# Altium project ColorESP32.PrjPcb
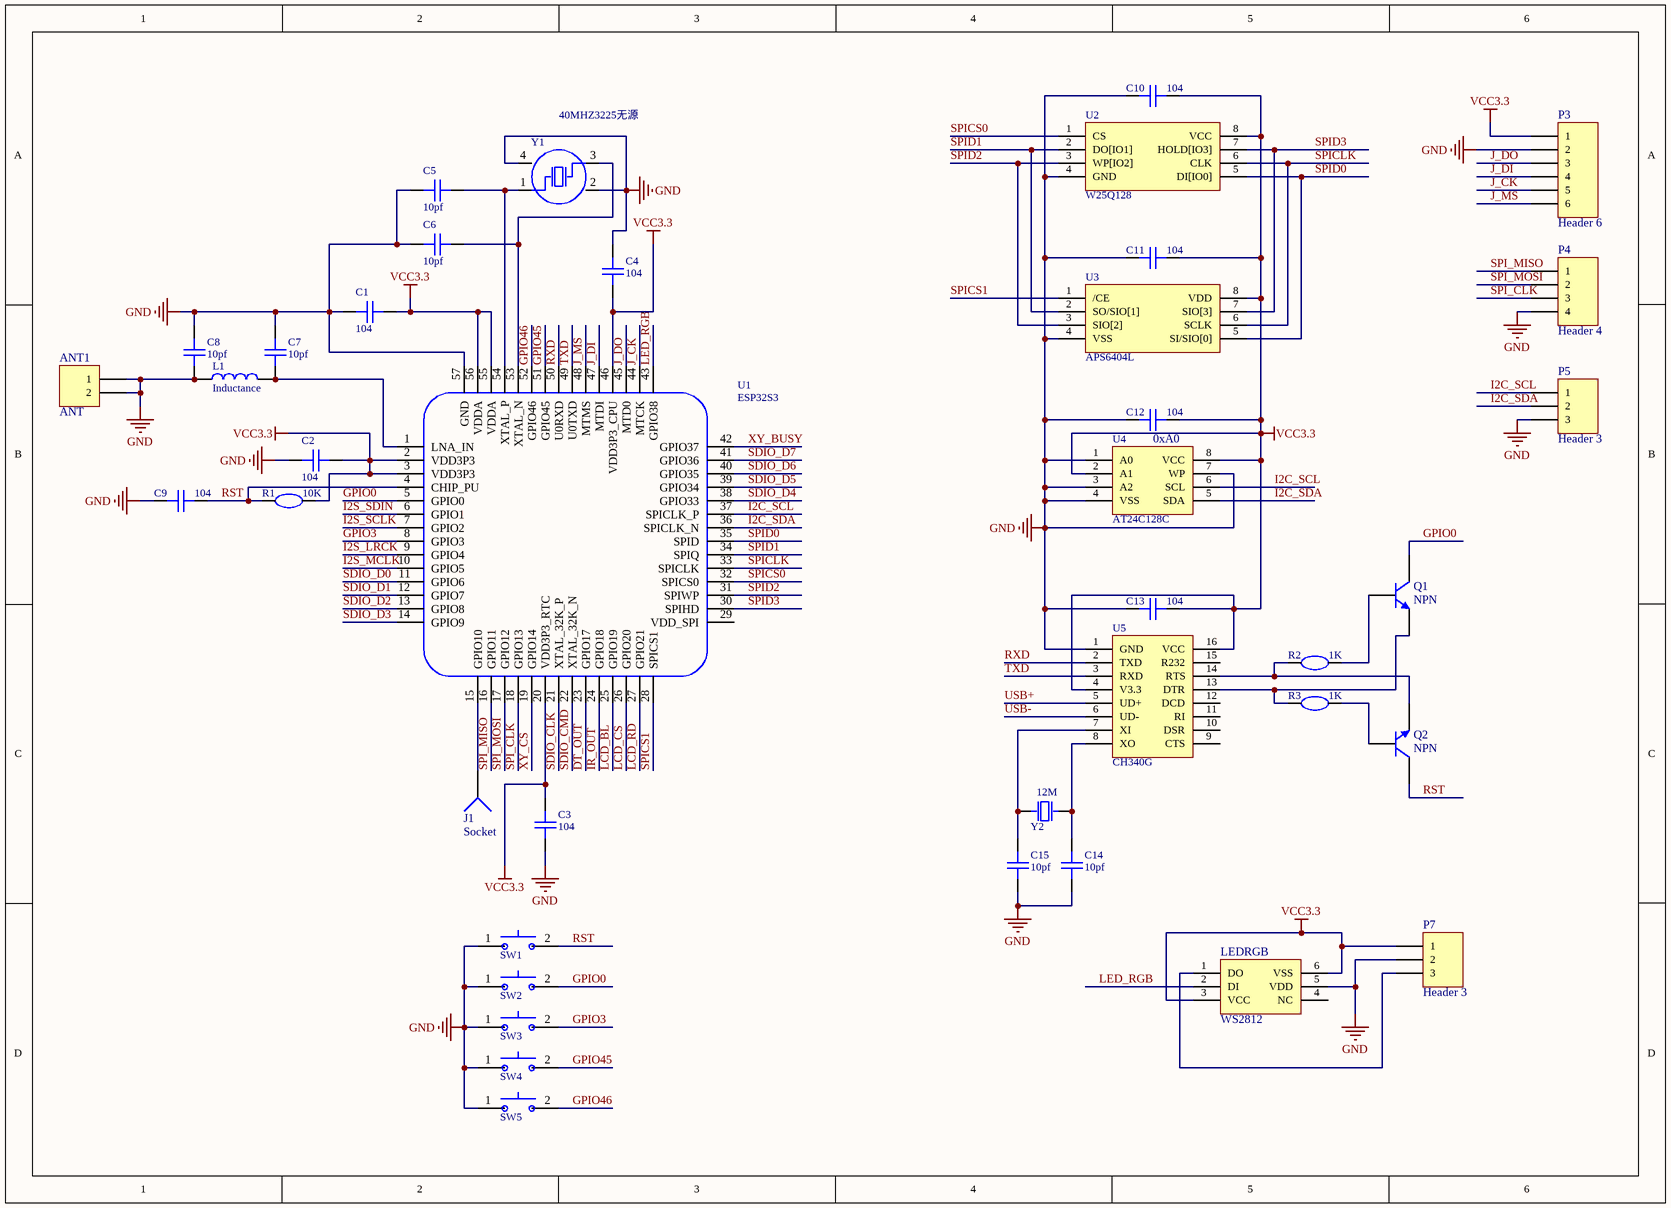
[diagram p0: 1_MCU.schdoc]
3 sheets, 82 parts. Net scope: global (net labels, ports and power ports of the same name join across sheets).
Board files: pcb.pcbdoc, PCB1_1.PcbDoc, PCB1.PcbDoc, PCB2.PcbDoc
Sheets:
  1_MCU.schdoc
  2_MODUE.schdoc
  3_AUDIO.schdoc

## Sheet 1_MCU.schdoc
size 312 x 225 mm; SheetNumber: 1; SheetTotal: 3

### Parts
ANT1  ANT  [MINI_ANT]
C1  104  [0402R]
C2  104  [0402R]
C3  104  [0402R]
C4  104  [0402R]
C5  10pf  [0603]
C6  10pf  [0603]
C7  10pf  [0603]
C8  10pf  [0603]
C9  104  [0402R]
C10  104  [0402R]
C11  104  [0402R]
C12  104  [0402R]
C13  104  [0402R]
C14  10pf  [0603]
C15  10pf  [0603]
J1  Socket  [PIN1]
L1  Inductance  [0603]
LEDRGB  WS2812  [LED-SMD_6P-L5.0-W5.0-TL]
P3  Header 6  [HDR1X6]
P4  Header 4  [HDR1X4]
P5  Header 3  [HDR1X3]
P7  Header 3  [HDR1X3]
Q1  NPN  [SOT-23-3_L2.9-W1.3-P1.90-LS2.4-BR]
Q2  NPN  [SOT-23-3_L2.9-W1.3-P1.90-LS2.4-BR]
R1  10K  [0402R]
R2  1K  [0402R]
R3  1K  [0402R]
SW1  无声微动开关  [SW-SMD_L6.0-W6.0-P6.00-LS6.6]  (value not drawn)
SW2  无声微动开关  [SW-SMD_L6.0-W6.0-P6.00-LS6.6]  (value not drawn)
SW3  无声微动开关  [SW-SMD_L6.0-W6.0-P6.00-LS6.6]  (value not drawn)
SW4  无声微动开关  [SW-SMD_L6.0-W6.0-P6.00-LS6.6]  (value not drawn)
SW5  无声微动开关  [SW-SMD_L6.0-W6.0-P6.00-LS6.6]  (value not drawn)
U1  ESP32S3  [ESP32-S3-QFN56]
U2  W25Q128  [SOIC-8_L5.3-W5.3-P1.27-LS8.0-BL]
U3  APS6404L  [SOP-8_L4.9-W3.9-P1.27-LS6.0-BL]
U4  AT24C128C  [SOIC-8_L4.9-W3.9-P1.27-LS6.0-BL]
U5  CH340G  [CH340G]
Y1  Name: 40MHZ3225无源  [CRYSTAL-SMD_4P-L3.2-W2.5-BL]  (hidden comment: CRYSTAL1)
Y2  12M  [HC-49US_L11.5-W4.5-P4.88]

### Nets
GND: ANT1.1 ANT1.2 C1.1 C2.1 C3.1 C4.2 C5.1 C6.1 C7.2 C8.1 C8.2 C9.1 C10.1 C11.1 C12.1 C13.1 C14.1 C15.1 L1.1 LEDRGB.5(VDD) P3.2 P4.4 P5.3 P7.2 SW1.1 SW2.1 SW3.1 SW4.1 SW5.1 U1.57(GND) U2.4(GND) U3.4(VSS) U4.1(A0) U4.3(A2) U4.4(VSS) U4.7(WP) U5.1(GND) Y1.2(GND) Y1.4(GND)
VCC3.3: C1.2 C2.2 C3.2 C4.1 C10.2 C11.2 C12.2 C13.2 LEDRGB.3(VCC) LEDRGB.6(VSS) P3.1 P7.1 R1.2 U1.2(VDD3P3) U1.3(VDD3P3) U1.20(VDD3P3_RTC) U1.46(VDD3P3_CPU) U1.55(VDDA) U1.56(VDDA) U2.8(VCC) U3.8(VDD) U4.2(A1) U4.8(VCC) U5.4(V3.3) U5.16(VCC)
DT_OUT: U1.23(GPIO17)
GPIO0: Q1.1(C) SW2.2 U1.5(GPIO0)
GPIO3: SW3.2 U1.8(GPIO3)
GPIO45: SW4.2 U1.51(GPIO45)
GPIO46: SW5.2 U1.52(GPIO46)
I2C_SCL: P5.1 U1.37(SPICLK_P) U4.6(SCL)
I2C_SDA: P5.2 U1.36(SPICLK_N) U4.5(SDA)
I2S_LRCK: U1.9(GPIO4)
I2S_MCLK: U1.10(GPIO5)
I2S_SCLK: U1.7(GPIO2)
I2S_SDIN: U1.6(GPIO1)
IR_OUT: U1.24(GPIO18)
J_CK: P3.5 U1.44(MTCK)
J_DI: P3.4 U1.47(MTDI)
J_DO: P3.3 U1.45(MTD0)
J_MS: P3.6 U1.48(MTMS)
LCD_BL: U1.25(GPIO19)
LCD_CS: U1.26(GPIO20)
LCD_R~{D}: U1.27(GPIO21)
LED_RGB: LEDRGB.2(DI) U1.43(GPIO38)
RST: C9.2 Q2.1(C) R1.1 SW1.2 U1.4(CHIP_PU)
RXD: U1.50(U0RXD) U5.2(TXD)
SDIO_CLK: U1.21(XTAL_32K_P)
SDIO_CMD: U1.22(XTAL_32K_N)
SDIO_D0: U1.11(GPIO6)
SDIO_D1: U1.12(GPIO7)
SDIO_D2: U1.13(GPIO8)
SDIO_D3: U1.14(GPIO9)
SDIO_D4: U1.38(GPIO33)
SDIO_D5: U1.39(GPIO34)
SDIO_D6: U1.40(GPIO35)
SDIO_D7: U1.41(GPIO36)
SPI_CLK: P4.3 U1.18(GPIO13)
SPI_MISO: P4.1 U1.16(GPIO11)
SPI_MOSI: P4.2 U1.17(GPIO12)
SPICLK: U1.33(SPICLK) U2.6(CLK) U3.6(SCLK)
SPICS0: U1.32(SPICS0) U2.1(CS)
SPICS1: U1.28(SPICS1) U3.1(/CE)
SPID0: U1.35(SPID) U2.5(DI[IO0]) U3.5(SI/SIO[0])
SPID1: U1.34(SPIQ) U2.2(DO[IO1]) U3.2(SO/SIO[1])
SPID2: U1.31(SPIWP) U2.3(WP[IO2]) U3.3(SIO[2])
SPID3: U1.30(SPIHD) U2.7(HOLD[IO3]) U3.7(SIO[3])
TXD: U1.49(U0TXD) U5.3(RXD)
USB+: U5.5(UD+)
USB-: U5.6(UD-)
XY_BUSY: U1.42(GPIO37)
XY_CS: U1.19(GPIO14)
NetC5_2: C5.2 U1.54(XTAL_P) Y1.1(OSC1)
NetC6_2: C6.2 U1.53(XTAL_N) Y1.3(OSC2)
NetC7_1: C7.1 L1.2 U1.1(LNA_IN)
NetC14_2: C14.2 U5.8(XO) Y2.2(OSC2)
NetC15_2: C15.2 U5.7(XI) Y2.1(OSC1)
NetJ1_1: J1.1 U1.15(GPIO10)
NetLEDRGB_1: LEDRGB.1(DO) P7.3
NetQ1_2: Q1.2(B) R2.2
NetQ1_3: Q1.3(E) R3.1 U5.13(DTR)
NetQ2_2: Q2.2(B) R3.2
NetQ2_3: Q2.3(E) R2.1 U5.14(RTS)

Not connected (* = marked no-connect by the designer): LEDRGB 4(NC); U1 29(VDD_SPI); U5 9(CTS) 10(DSR) 11(RI) 12(DCD) 15(R232)

### Notes on the sheet
- 0xA0

### Library data of the parts
ANT1 = Header 2: LatestRevisionDate: 17-Jul-2002; LatestRevisionNote: Re-released for DXP Platform.; Publisher: Altium Limited
C1-C15 = CAP: Symbol: 0.1u; Add into BOM: yes; Origin Footprint: C0805; Device: 0.1u; Convert to PCB: yes
L1 = Inductance: Symbol: 1m; Add into BOM: yes; Origin Footprint: L1608; Device: 1m; Convert to PCB: yes
P3 = Header 6: Header, 6-Pin; LatestRevisionDate: 17-Jul-2002; LatestRevisionNote: Re-released for DXP Platform.; Publisher: Altium Limited
P4 = Header 4: Header, 4-Pin; LatestRevisionDate: 17-Jul-2002; LatestRevisionNote: Re-released for DXP Platform.; Publisher: Altium Limited
P5 P7 = Header 3: Header, 3-Pin; LatestRevisionDate: 17-Jul-2002; LatestRevisionNote: Re-released for DXP Platform.; Publisher: Altium Limited
Q1 Q2 = NPN: NPN Bipolar Transistor; Published: 8-Jun-2000; LatestRevisionDate: 17-Jul-2002; LatestRevisionNote: Re-released for DXP Platform.; PackageReference: TO-226-AA; Publisher: Altium Limited; PackageDescription: TO, Flat Index; 3 In-Line, Axial Leads; Body Dia. 4.8mm; Leads 0.55 x 0.51 mm (max); Code_JEDEC: TO-226-AA
R1-R3 = RST: Symbol: 0_; Add into BOM: yes; Origin Footprint: R0805; Device: 0_; Convert to PCB: yes
SW1-SW5 = SW: Add into BOM: yes; Symbol: 无声微动开关; Name: 无声微动开关; Device: 无声微动开关; Convert to PCB: yes; Origin Footprint: SW-SMD_L6.0-W6.0-P6.00-LS6.6
U1 = ESP32S3: Add into BOM: yes; Symbol: ESP32S3; Device: ESP32S3; Convert to PCB: yes; Origin Footprint: ESP32-S3-QFN56
U2 = W25Q128: Symbol: W25Q128JVSIQ; Add into BOM: yes; Device: W25Q128JVSIQ; Convert to PCB: yes; Origin Footprint: SOIC-8_L5.3-W5.3-P1.27-LS8.0-BL
U3 = APS6404L: Symbol: APS6404L-3SQR-SN; Add into BOM: yes; Device: APS6404L-3SQR-SN; Convert to PCB: yes; Origin Footprint: SOP-8_L4.9-W3.9-P1.27-LS6.0-BL; link: https://img.jlc.com/pdf/applyPasteComponent/2021-12-06/31098A/66796366ab5e49f0a48d07582eff2f2b/APS6404L-3SQR-SN.pdf
U4 = AT24C128C: Symbol: AT24C128C-SSHM-T; Add into BOM: yes; Device: AT24C128C-SSHM-T; Convert to PCB: yes; Origin Footprint: SOIC-8_L4.9-W3.9-P1.27-LS6.0-BL
U5 = CH340G: Add into BOM: yes; Symbol: CH340G; Device: CH340G; Convert to PCB: yes; Origin Footprint: CH340G
Y1 = CRYSTAL1: Symbol: 25MHZ3225无源; Add into BOM: yes; Device: 25MHZ3225无源; Convert to PCB: yes; Origin Footprint: CRYSTAL-SMD_4P-L3.2-W2.5-BL
Y2 = CRYSTAL: Symbol: 9B-12.288MAAJ-B; Add into BOM: yes; Name: 9B-12.288MAAJ-B; Device: 9B-12.288MAAJ-B; Convert to PCB: yes; Origin Footprint: HC-49US_L11.5-W4.5-P4.88
J1 = Socket: LatestRevisionDate: 17-Jul-2002; LatestRevisionNote: Re-released for DXP Platform.; Publisher: Altium Limited

## Sheet 2_MODUE.schdoc
size 312 x 225 mm; SheetNumber: 2; SheetTotal: 3
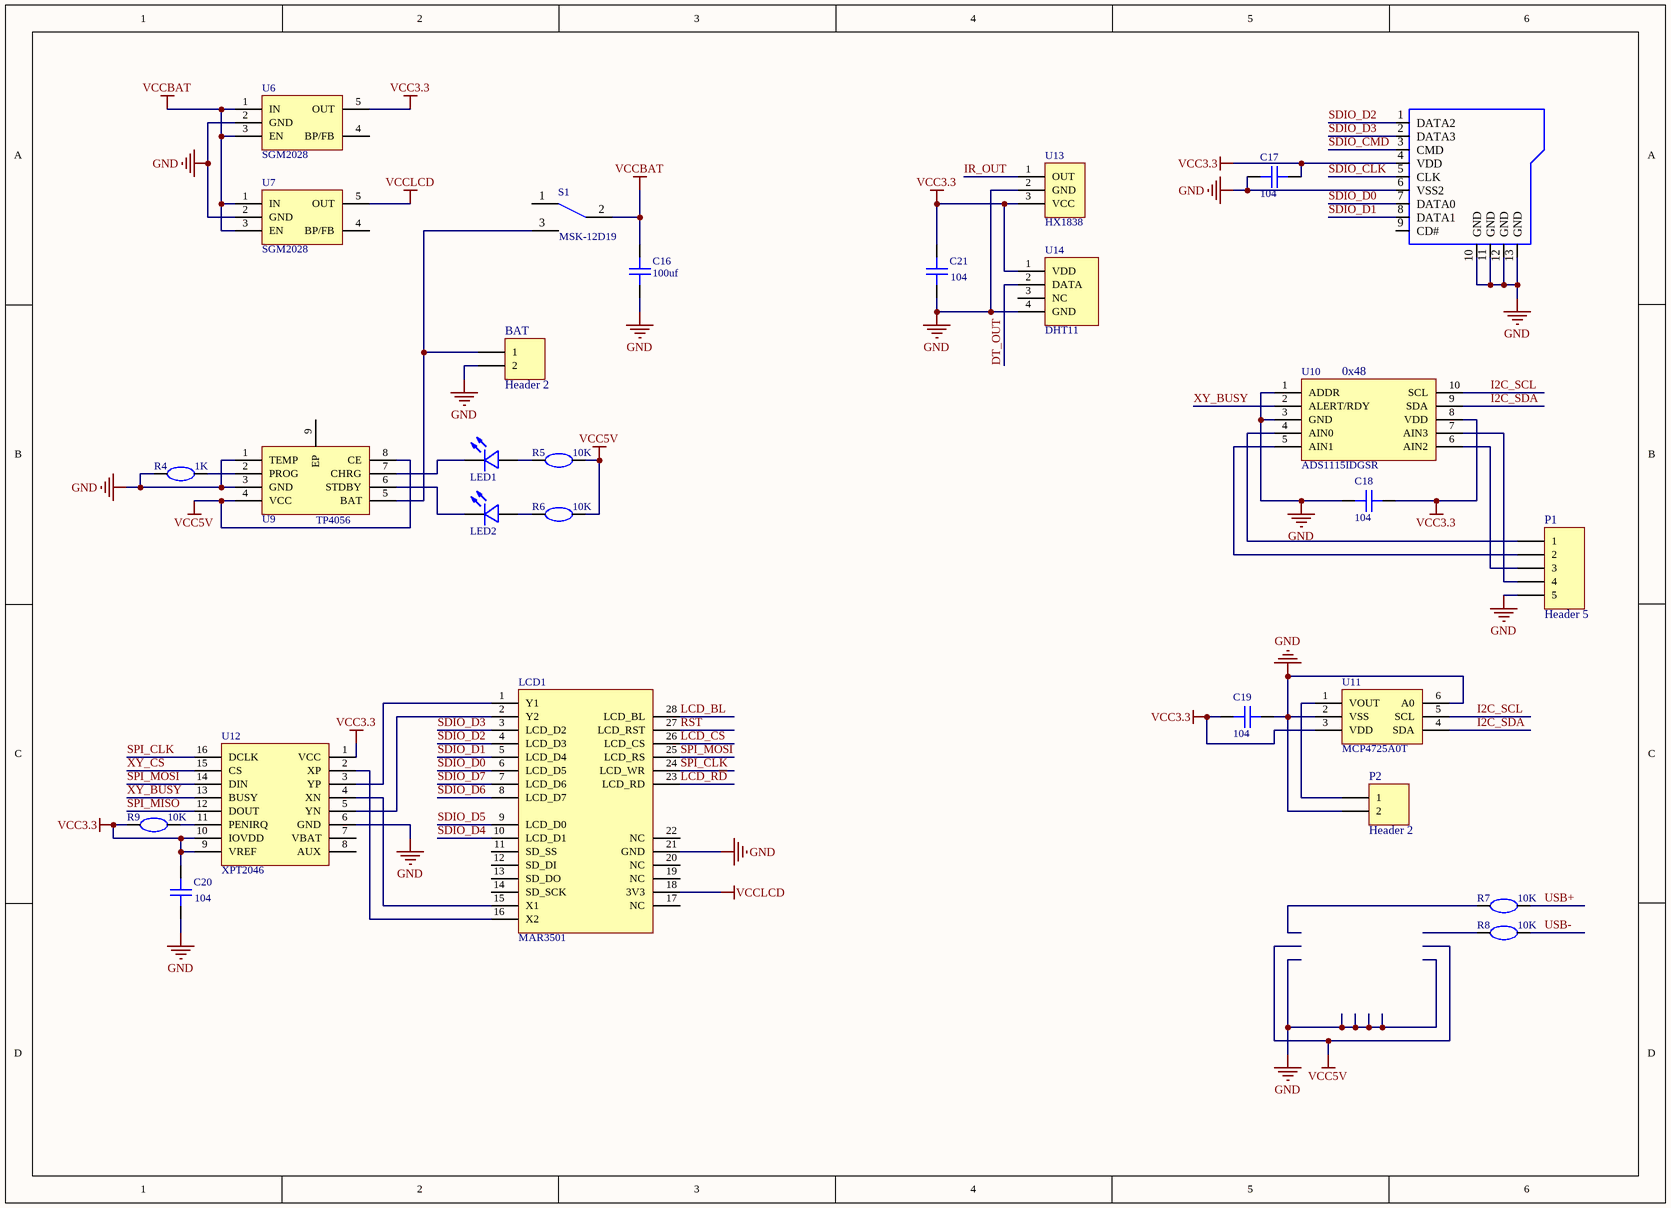
[diagram p1: 2_MODUE.schdoc]

### Parts
BAT  Header 2  [HDR1X2]
C16  100uf  [3528]
C17  104  [0402R]
C18  104  [0402R]
C19  104  [0402R]
C20  104  [0402R]
C21  104  [0402R]
LCD1  MAR3501  [MAR3501]
LED1  L-C292WDT-5A-YY  [0805]  (value not drawn)
LED2  L-C292WDT-5A-YY  [0805]  (value not drawn)
P1  Header 5  [HDR1X5]
P2  Header 2  [HDR1X2]
R4  1K  [0402R]
R5  10K  [0402R]
R6  10K  [0402R]
R7  10K  [0805]
R8  10K  [0805]
R9  10K  [0402R]
S1  MSK-12D19  [MSK-12D19]
TF1  TF  [TF-SMD_XKTF-N02-N_1]  (value not drawn)
U6  SGM2028  [SOT-23-5_L3.0-W1.7-P0.95-LS2.8-BR]
U7  SGM2028  [SOT-23-5_L3.0-W1.7-P0.95-LS2.8-BR]
U9  TP4056  [ESOP-8_L4.9-W3.9-P1.27-LS6.0-BL-EP]
U10  ADS1115IDGSR  [MSOP-10_L3.0-W3.0-P0.50-LS5.0-BL]
U11  MCP4725A0T  [SOT-23-6_L2.9-W1.6-P0.95-LS2.8-BR]
U12  XPT2046  [TSSOP-16_L5.0-W4.4-P0.65-LS6.4-BL]
U13  HX1838  [HX1838]
U14  DHT11  [SENSOR-TH_DHT11]

### Nets
GND: BAT.2 C16.1 C17.2 C18.2 C19.2 C20.1 C21.1 LCD1.21(GND) P1.5 P2.2 R4.1 TF1.6(VSS2) TF1.10(GND) TF1.11(GND) TF1.12(GND) TF1.13(GND) U6.2(GND) U7.2(GND) U9.1(TEMP) U9.3(GND) U10.1(ADDR) U10.3(GND) U11.2(VSS) U11.6(A0) U12.6(GND) U13.2(GND) U14.4(GND)
VCC3.3: C17.1 C18.1 C19.1 C20.2 C21.2 R9.1 TF1.4(VDD) U6.5(OUT) U10.8(VDD) U11.3(VDD) U12.1(VCC) U12.9(VREF) U12.10(IOVDD) U13.3(VCC) U14.1(VDD)
VCC5V: R5.2 R6.2 U9.4(VCC) U9.8(CE)
VCCBAT: C16.2 S1.2(B) U6.1(IN) U6.3(EN) U7.1(IN) U7.3(EN)
VCCLCD: LCD1.18(3V3) U7.5(OUT)
DT_OUT: U14.2(DATA)
I2C_SCL: U10.10(SCL) U11.5(SCL)
I2C_SDA: U10.9(SDA) U11.4(SDA)
IR_OUT: U13.1(OUT)
LCD_BL: LCD1.28(LCD_BL)
LCD_CS: LCD1.26(LCD_CS)
LCD_R~{D}: LCD1.23(LCD_RD)
RST: LCD1.27(LCD_RST)
SDIO_CLK: TF1.5(CLK)
SDIO_CMD: TF1.3(CMD)
SDIO_D0: LCD1.6(LCD_D5) TF1.7(DATA0)
SDIO_D1: LCD1.5(LCD_D4) TF1.8(DATA1)
SDIO_D2: LCD1.4(LCD_D3) TF1.1(DATA2)
SDIO_D3: LCD1.3(LCD_D2) TF1.2(DATA3)
SDIO_D4: LCD1.10(LCD_D1)
SDIO_D5: LCD1.9(LCD_D0)
SDIO_D6: LCD1.8(LCD_D7)
SDIO_D7: LCD1.7(LCD_D6)
SPI_CLK: LCD1.24(LCD_WR) U12.16(DCLK)
SPI_MISO: U12.12(DOUT)
SPI_MOSI: LCD1.25(LCD_RS) U12.14(DIN)
USB+: R7.2
USB-: R8.2
XY_BUSY: U10.2(ALERT/RDY) U12.13(BUSY)
XY_CS: U12.15(CS)
NetBAT_1: BAT.1 S1.3(C) U9.5(BAT)
NetLCD1_1: LCD1.1(Y1) U12.3(YP)
NetLCD1_2: LCD1.2(Y2) U12.5(YN)
NetLCD1_15: LCD1.15(X1) U12.4(XN)
NetLCD1_16: LCD1.16(X2) U12.2(XP)
NetLED1_1: LED1.1(+) R5.1
NetLED1_2: LED1.2(-) U9.7(CHRG)
NetLED2_1: LED2.1(+) R6.1
NetLED2_2: LED2.2(-) U9.6(STDBY)
NetP1_1: P1.1 U10.4(AIN0)
NetP1_2: P1.2 U10.5(AIN1)
NetP1_3: P1.3 U10.6(AIN2)
NetP1_4: P1.4 U10.7(AIN3)
NetP2_1: P2.1 U11.1(VOUT)
NetR4_2: R4.2 U9.2(PROG)
NetR9_2: R9.2 U12.11(PENIRQ)

Not connected (* = marked no-connect by the designer): LCD1 11(SD_SS) 12(SD_DI) 13(SD_DO) 14(SD_SCK) 17(NC) 19(NC) 20(NC) 22(NC); R7 1; R8 1; S1 1(A); TF1 9(CD#); U6 4(BP/FB); U7 4(BP/FB); U9 9(EP); U12 7(VBAT) 8(AUX); U14 3(NC)

### Notes on the sheet
- (near U10) 0x48

### Library data of the parts
BAT P2 = Header 2: Header, 2-Pin; LatestRevisionDate: 17-Jul-2002; LatestRevisionNote: Re-released for DXP Platform.; Publisher: Altium Limited
C16-C21 = CAP: as C1 on sheet 1_MCU; Device: 0.1u; Convert to PCB: yes
LCD1 = MAR3501: Add into BOM: yes; Symbol: MAR3501; Device: MAR3501; Convert to PCB: yes; Origin Footprint: MAR3501
LED1 LED2 = LED: Add into BOM: yes; Origin Footprint: LED0805-RD; Symbol: L-C292WDT-5A-YY; Name: L-C292WDT-5A-YY; Device: L-C292WDT-5A-YY; Convert to PCB: yes
P1 = Header 5: Header, 5-Pin; LatestRevisionDate: 17-Jul-2002; LatestRevisionNote: Re-released for DXP Platform.; Publisher: Altium Limited
R4-R9 = RST: as R1 on sheet 1_MCU; Device: 0_; Convert to PCB: yes
S1 = MSK-12D19: Add into BOM: yes; Symbol: MSK-12D19; Device: MSK-12D19; Convert to PCB: yes; Origin Footprint: MSK-12D19; Name: MSK-12D19
TF1 = TF: Symbol: TF_1; Add into BOM: yes; Device: TF_1; Convert to PCB: yes
U6 U7 = SGM2028: Symbol: SGM2028-3.3YN5G/TR; Add into BOM: yes; Device: SGM2028-3.3YN5G/TR; Convert to PCB: yes; Origin Footprint: SOT-23-5_L3.0-W1.7-P0.95-LS2.8-BR
U9 = TP4056: Symbol: TP4056_C725790; Add into BOM: yes; Device: TP4056_C725790; Convert to PCB: yes; Origin Footprint: ESOP-8_L4.9-W3.9-P1.27-LS6.0-BL-EP
U10 = ADS1115IDGSR: Add into BOM: yes; Symbol: ADS1115IDGSR; Device: ADS1115IDGSR; Convert to PCB: yes; Origin Footprint: MSOP-10_L3.0-W3.0-P0.50-LS5.0-BL
U11 = MCP4725A0T: Symbol: MCP4725A0T-E/CH; Add into BOM: yes; Device: MCP4725A0T-E/CH; Convert to PCB: yes; Origin Footprint: SOT-23-6_L2.9-W1.6-P0.95-LS2.8-BR
U12 = XPT2046: Add into BOM: yes; Symbol: XPT2046; Device: XPT2046; Convert to PCB: yes; Origin Footprint: TSSOP-16_L5.0-W4.4-P0.65-LS6.4-BL
U13 = HX1838: Add into BOM: yes; Symbol: HX1838; Device: HX1838; Convert to PCB: yes; Origin Footprint: HX1838; link: HX1838
U14 = DHT11: Add into BOM: yes; Symbol: DHT11; Device: DHT11; Convert to PCB: yes; Origin Footprint: SENSOR-TH_DHT11

## Sheet 3_AUDIO.schdoc
size 312 x 225 mm; SheetNumber: 3; SheetTotal: 3
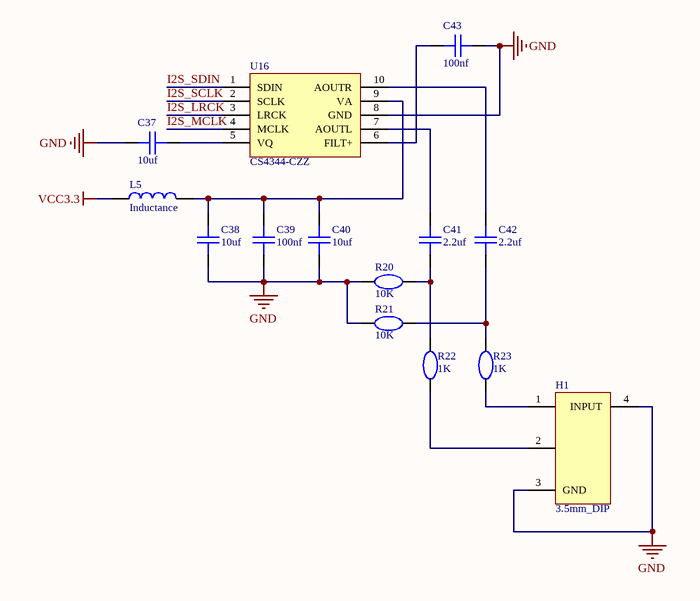
[diagram p2: 3_AUDIO.schdoc]

### Parts
C37  10uf  [3216]
C38  10uf  [3216]
C39  100nf  [3216]
C40  10uf  [3216]
C41  2.2uf  [0805]
C42  2.2uf  [0805]
C43  100nf  [3216]
H1  3.5mm_DIP  [PJ320D]
L5  Inductance  [0805]
R20  10K  [0402R]
R21  10K  [0402R]
R22  1K  [0402R]
R23  1K  [0402R]
U16  CS4344-CZZ  [TSSOP-10_L3.0-W3.0-P0.50-LS4.9-BL]

### Nets
GND: C37.2 C38.2 C39.2 C40.2 C43.2 H1.3(GND) H1.4(INPUT) R20.2 R21.2 U16.8(GND)
VCC3.3: L5.1
I2S_LRCK: U16.3(LRCK)
I2S_MCLK: U16.4(MCLK)
I2S_SCLK: U16.2(SCLK)
I2S_SDIN: U16.1(SDIN)
NetC37_1: C37.1 U16.5(VQ)
NetC38_1: C38.1 C39.1 C40.1 L5.2 U16.9(VA)
NetC41_1: C41.1 U16.7(AOUTL)
NetC41_2: C41.2 R20.1 R22.1
NetC42_1: C42.1 U16.10(AOUTR)
NetC42_2: C42.2 R21.1 R23.1
NetC43_1: C43.1 U16.6(FILT+)
NetH1_1: H1.1 R23.2
NetH1_2: H1.2 R22.2

### Library data of the parts
C37-C43 = CAP: as C1 on sheet 1_MCU; Device: 0.1u; Convert to PCB: yes
H1 = 3.5mm_DIP: Add into BOM: yes; Symbol: 3.5mm_DIP; Device: 3.5mm_DIP; Convert to PCB: yes; Origin Footprint: PJ320D
L5 = Inductance: as L1 on sheet 1_MCU; Device: 1m; Convert to PCB: yes
R20-R23 = RST: as R1 on sheet 1_MCU; Device: 0_; Convert to PCB: yes
U16 = CS4344-CZZ: Add into BOM: yes; Symbol: CS4344-CZZ; Device: CS4344-CZZ; Convert to PCB: yes; Origin Footprint: TSSOP-10_L3.0-W3.0-P0.50-LS4.9-BL

## Nets that join several sheets
GND: 1_MCU (39 pins), 2_MODUE (27 pins), 3_AUDIO (10 pins)
VCC3.3: 1_MCU (25 pins), 2_MODUE (15 pins), 3_AUDIO (L5.1)
DT_OUT: 1_MCU (U1.23), 2_MODUE (U14.2)
I2C_SCL: 1_MCU (P5.1 U1.37 U4.6), 2_MODUE (U10.10 U11.5)
I2C_SDA: 1_MCU (P5.2 U1.36 U4.5), 2_MODUE (U10.9 U11.4)
I2S_LRCK: 1_MCU (U1.9), 3_AUDIO (U16.3)
I2S_MCLK: 1_MCU (U1.10), 3_AUDIO (U16.4)
I2S_SCLK: 1_MCU (U1.7), 3_AUDIO (U16.2)
I2S_SDIN: 1_MCU (U1.6), 3_AUDIO (U16.1)
IR_OUT: 1_MCU (U1.24), 2_MODUE (U13.1)
LCD_BL: 1_MCU (U1.25), 2_MODUE (LCD1.28)
LCD_CS: 1_MCU (U1.26), 2_MODUE (LCD1.26)
LCD_R~{D}: 1_MCU (U1.27), 2_MODUE (LCD1.23)
RST: 1_MCU (5 pins), 2_MODUE (LCD1.27)
SDIO_CLK: 1_MCU (U1.21), 2_MODUE (TF1.5)
SDIO_CMD: 1_MCU (U1.22), 2_MODUE (TF1.3)
SDIO_D0: 1_MCU (U1.11), 2_MODUE (LCD1.6 TF1.7)
SDIO_D1: 1_MCU (U1.12), 2_MODUE (LCD1.5 TF1.8)
SDIO_D2: 1_MCU (U1.13), 2_MODUE (LCD1.4 TF1.1)
SDIO_D3: 1_MCU (U1.14), 2_MODUE (LCD1.3 TF1.2)
SDIO_D4: 1_MCU (U1.38), 2_MODUE (LCD1.10)
SDIO_D5: 1_MCU (U1.39), 2_MODUE (LCD1.9)
SDIO_D6: 1_MCU (U1.40), 2_MODUE (LCD1.8)
SDIO_D7: 1_MCU (U1.41), 2_MODUE (LCD1.7)
SPI_CLK: 1_MCU (P4.3 U1.18), 2_MODUE (LCD1.24 U12.16)
SPI_MISO: 1_MCU (P4.1 U1.16), 2_MODUE (U12.12)
SPI_MOSI: 1_MCU (P4.2 U1.17), 2_MODUE (LCD1.25 U12.14)
USB+: 1_MCU (U5.5), 2_MODUE (R7.2)
USB-: 1_MCU (U5.6), 2_MODUE (R8.2)
XY_BUSY: 1_MCU (U1.42), 2_MODUE (U10.2 U12.13)
XY_CS: 1_MCU (U1.19), 2_MODUE (U12.15)